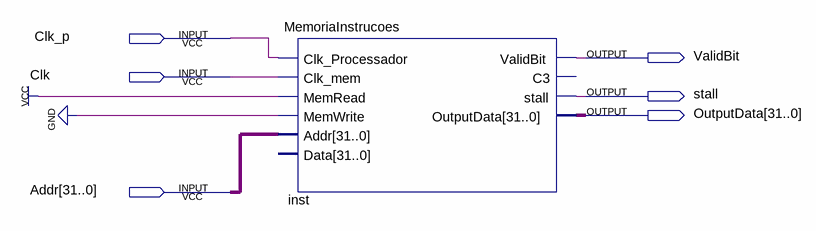
[diagram p0: schematic sheet]
// Quartus schematic MemoriaInstrucoesFinal.bdf as structural Verilog: 1 symbols, 6 pins
module MemoriaInstrucoesFinal (
  input  Clk_p,
  input  Clk,
  input  [31:0] Addr,
  output ValidBit,
  output stall,
  output [31:0] OutputData
);

  MemoriaInstrucoes inst (
    .Clk_Processador(Clk_p), .Clk_mem(Clk), .MemRead(1'b1), .MemWrite(1'b0), .Addr(Addr),
    .ValidBit(ValidBit), .stall(stall), .OutputData(OutputData));  // open: Data, C3
endmodule
